# EAGLE schematic tentacle_module (EAGLE 7.1.0)
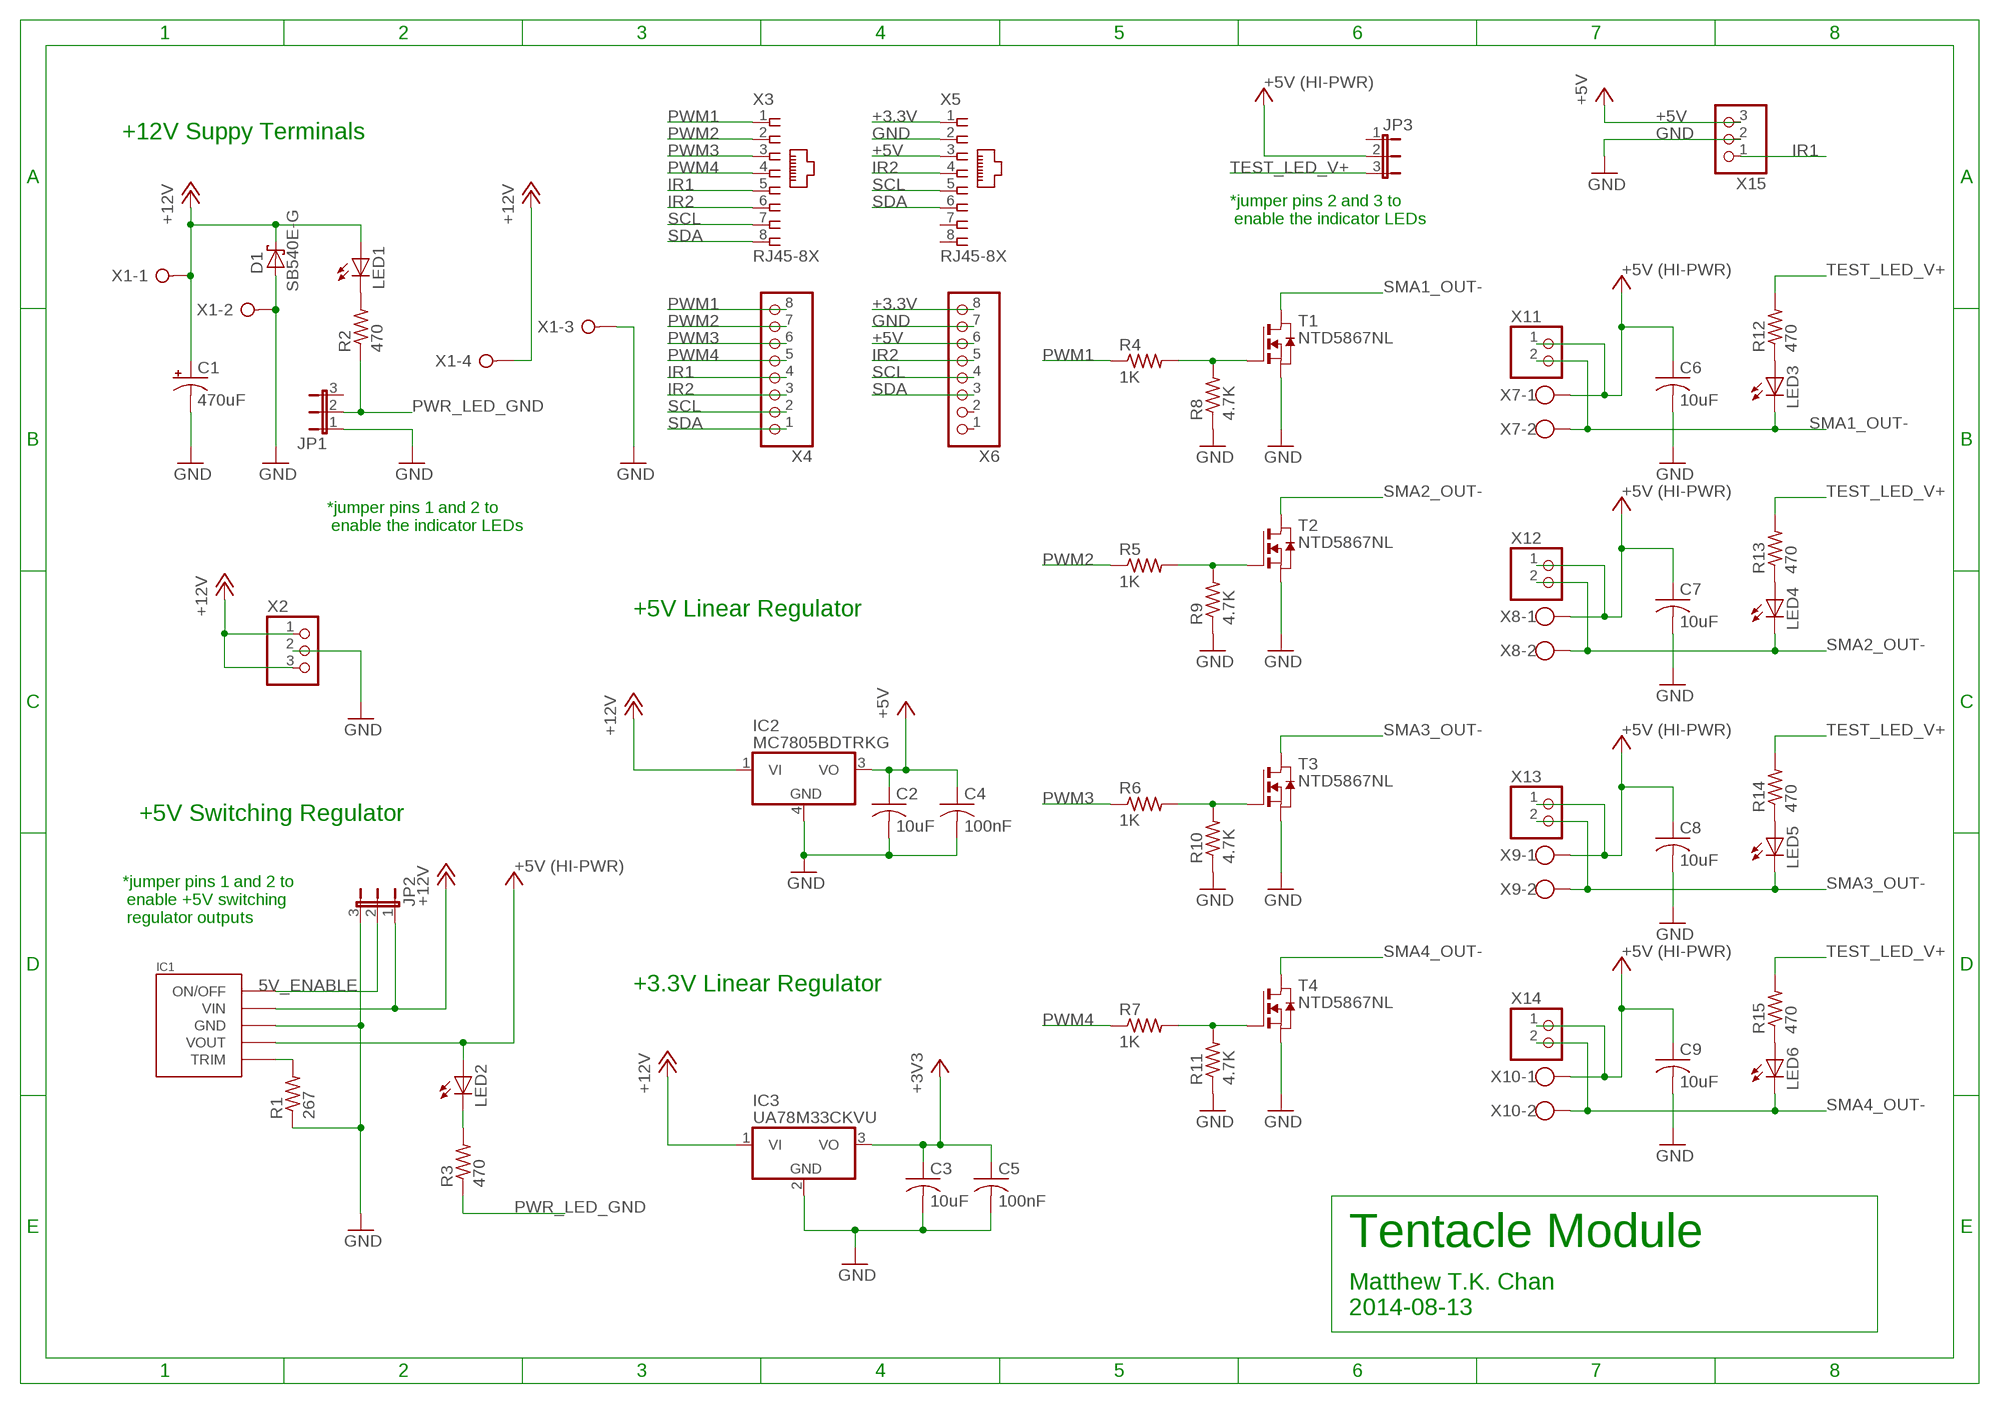
[diagram p0: schematic, sheet 1]

## Parts
C1  470uF  CPOL-USE5-10.5  [E5-10,5]
C2  10uF  C-USC1206  [C1206]
C3  10uF  C-USC1206  [C1206]
C4  100nF  C-USC0603  [C0603]
C5  100nF  C-USC0603  [C0603]
C6  10uF  C-USC1206  [C1206]
C7  10uF  C-USC1206  [C1206]
C8  10uF  C-USC1206  [C1206]
C9  10uF  C-USC1206  [C1206]
D1  SB540E-G  [DO201T15]
IC1  OKR-T/10-W12  [OKR-C90]
IC2  MC7805BDTRKG  [DPACK_3]
IC3  UA78M33CKVU  [DPACK]
JP1  JP2E  [JP2]
JP2  JP2E  [JP2]
JP3  JP2E  [JP2]
LED1  LEDSML1206  [SML1206]
LED2  LEDSML1206  [SML1206]
LED3  LEDSML1206  [SML1206]
LED4  LEDSML1206  [SML1206]
LED5  LEDSML1206  [SML1206]
LED6  LEDSML1206  [SML1206]
R1  267  R-US_R0603  [R0603]
R2  470  R-US_R0603  [R0603]
R3  470  R-US_R0603  [R0603]
R4  1K  R-US_R0603  [R0603]
R5  1K  R-US_R0603  [R0603]
R6  1K  R-US_R0603  [R0603]
R7  1K  R-US_R0603  [R0603]
R8  4.7K  R-US_R0603  [R0603]
R9  4.7K  R-US_R0603  [R0603]
R10  4.7K  R-US_R0603  [R0603]
R11  4.7K  R-US_R0603  [R0603]
R12  470  R-US_R0603  [R0603]
R13  470  R-US_R0603  [R0603]
R14  470  R-US_R0603  [R0603]
R15  470  R-US_R0603  [R0603]
T1  NTD5867NL  NTD5867NLT4G  [DPACK]
T2  NTD5867NL  NTD5867NLT4G  [DPACK]
T3  NTD5867NL  NTD5867NLT4G  [DPACK]
T4  NTD5867NL  NTD5867NLT4G  [DPACK]
X1  W237-04P  [W237-4P]
X2  PINHD-1X3/90  [1X03/90]
X3  RJ45-8X  [RJ45-NO-SHIELD]
X4  PINHD-1X8  [1X08]
X5  RJ45-8X  [RJ45-NO-SHIELD]
X6  PINHD-1X8  [1X08]
X7  W237-102  [W237-102]
X8  W237-102  [W237-102]
X9  W237-102  [W237-102]
X10  W237-102  [W237-102]
X11  PINHD-1X2/90  [1X02/90]
X12  PINHD-1X2/90  [1X02/90]
X13  PINHD-1X2/90  [1X02/90]
X14  PINHD-1X2/90  [1X02/90]
X15  PINHD-1X3/90  [1X03/90]

## Nets
5V_ENABLE: IC1.ON/OFF JP2.2
+3.3V: C3.1 C5.1 IC3.3(VO) X5.1 X6.8 ; supply symbol labelled +3V3
+5V: C2.1 C4.1 IC2.3(VO) X5.3 X6.6 X15.3
+5V_HI-PWR: C6.1 C7.1 C8.1 C9.1 IC1.VOUT JP3.2 LED2.A X7.1 X8.1 X9.1 X10.1 X11.1 X12.1 X13.1 X14.1 ; supply symbol labelled +5V (HI-PWR)
+12V: C1.+ D1.C IC1.VIN IC2.1(VI) IC3.1(VI) JP2.1 LED1.A X1.1 X1.4 X2.1 X2.3
GND: C1.- C2.2 C3.2 C4.2 C5.2 C6.2 C7.2 C8.2 C9.2 D1.A IC1.GND IC2.4(GND) IC3.2(GND) JP1.1 JP2.3 R1.1 R8.1 R9.1 R10.1 R11.1 T1.3(S) T2.3(S) T3.3(S) T4.3(S) X1.2 X1.3 X2.2 X5.2 X6.7 X15.2
IR1: X3.5 X4.4 X15.1
IR2: X3.6 X4.3 X5.4 X6.5
N$1: R5.2 R9.2 T2.1(G)
N$2: R6.2 R10.2 T3.1(G)
N$3: R7.2 R11.2 T4.1(G)
N$4: R4.2 R8.2 T1.1(G)
N$5: LED3.A R12.1
N$6: IC1.TRIM R1.2
N$7: LED2.C R3.2
N$10: LED1.C R2.2
N$12: LED4.A R13.1
N$13: LED5.A R14.1
N$14: LED6.A R15.1
PWM1: R4.1 X3.1 X4.8
PWM2: R5.1 X3.2 X4.7
PWM3: R6.1 X3.3 X4.6
PWM4: R7.1 X3.4 X4.5
PWR_LED_GND: JP1.2 R2.1 R3.1
SCL: X3.7 X4.2 X5.5 X6.4
SDA: X3.8 X4.1 X5.6 X6.3
SMA1_OUT-: LED3.C T1.2(D) X7.2 X11.2
SMA2_OUT-: LED4.C T2.2(D) X8.2 X12.2
SMA3_OUT-: LED5.C T3.2(D) X9.2 X13.2
SMA4_OUT-: LED6.C T4.2(D) X10.2 X14.2
TEST_LED_V+: JP3.3 R12.2 R13.2 R14.2 R15.2
Unconnected: JP1.3 JP3.1 X5.7 X5.8 X6.1 X6.2

## Notes on the sheet
- +12V Suppy Terminals
- *jumper pins 2 and 3 to
   enable the indicator LEDs
- *jumper pins 1 and 2 to
   enable the indicator LEDs
- +5V Linear Regulator
- +5V Switching Regulator
- *jumper pins 1 and 2 to
   enable +5V switching 
   regulator outputs
- +3.3V Linear Regulator
- Tentacle Module
- Matthew T.K. Chan
  2014-08-13

## Library data of the parts
C1 = rcl:CPOL-US: POLARIZED CAPACITOR, American symbol
C2-C9 = rcl:C-US: CAPACITOR, American symbol
D1 = CBLA_Test_bed_Library:SB540E-G: SCHOTTKY BARRIER RECTIFIER 3.0 AMPERES 20, 30, 40 VOLT Source: MBRS340T3-D.pdf
IC1 = CBLA_Test_bed_Library:OKR-T/10-W12: 5V/10A Murata POL DC/DC Converter
IC2 = CBLA_Test_bed_Library:MC78: 1A Positive Voltage Regulators Source: Data sheet <http://www.onsemi.com/pub_link/Collateral/MC7800-D.PDF>
IC3 = CBLA_Test_bed_Library:UA78M: Linear Voltage Reg Datasheet <http://www.ti.com/lit/ds/symlink/ua78m05.pdf>
JP1-JP3 = jumper:JP2E: JUMPER
LED1-LED6 = led:LED: LED OSRAM: - CHIPLED LG R971, LG N971, LY N971, LG Q971, LY Q971, LO R971, LY R971 LH N974, LH R974 LS Q976, LO Q976, LY Q976 LO Q996 - Hyper CHIPLED LW Q18S LB Q993, LB Q99A, LB R99A - SideLED LS A670, LO A670, LY A670, LG A670, LP A670 LB A673, LV A673, LT A673, LW A673 LH A674 LY A675 LS A676, LA A676, LO A676, LY A676, LW A676 LS A679, LY A679, LG A679 - Hyper Micro SIDELED® LS Y876, LA Y876, LO Y876, LY Y876 LT Y87S - SmartLED LW L88C, LW L88S LB L89C, LB L89S, LG L890 LS L89K, LO L89K, LY L89K LS L896, LA L896, LO L896, LY L896 - TOPLED LS T670, LO T670, LY T670, LG T670, LP T670 LSG T670, LSP T670, LSY T670, LOP T670, LYG T670 LG T671, LOG T671, LSG T671 LB T673, LV T673, LT T673, LW T673 LH T674 LS T676, LA T676, LO T676, LY T676, LB T676, LH T676, LSB T676, LW T676 LB T67C, LV T67C, LT T67C, LS T67K, LO T67K, LY T67K, LW E67C LS E67B, LA E67B, LO E67B, LY E67B, LB E67C, LV E67C, LT E67C LW T67C LS T679, LY T679, LG T679 LS T770, LO T770, LY T770, LG T770, LP T770 LB T773, LV T773, LT T773, LW T773 LH T774 LS E675, LA E675, LY E675, LS T675 LS T776, LA T776, LO T776, LY T776, LB T776 LHGB T686 LT T68C, LB T68C - Hyper Mini TOPLED® LB M676 - Mini TOPLED Santana® LG M470 LS M47K, LO M47K, LY M47K Source: http://www.osram.convergy.de LUXEON: - LUMILED® LXK2-PW12-R00, LXK2-PW12-S00, LXK2-PW14-U00, LXK2-PW14-V00 LXK2-PM12-R00, LXK2-PM12-S00, LXK2-PM14-U00 LXK2-PE12-Q00, LXK2-PE12-R00, LXK2-PE12-S00, LXK2-PE14-T00, LXK2-PE14-U00 LXK2-PB12-K00, LXK2-PB12-L00, LXK2-PB12-M00, LXK2-PB14-N00, LXK2-PB14-P00, LXK2-PB14-Q00 LXK2-PR12-L00, LXK2-PR12-M00, LXK2-PR14-Q00, LXK2-PR14-R00 LXK2-PD12-Q00, LXK2-PD12-R00, LXK2-PD12-S00 LXK2-PH12-R00, LXK2-PH12-S00 LXK2-PL12-P00, LXK2-PL12-Q00, LXK2-PL12-R00 Source: www.luxeon.com KINGBRIGHT: KA-3528ASYC Source: www.kingbright.com
R1-R15 = CBLA_Test_bed_Library:R-US_: RESISTOR, American symbol
T1-T4 = CBLA_Test_bed_Library:NTD5867NL: MOS FET
X1 = con-wago-508:W237-04P: WAGO SREW CLAMP; OC_FARNELL: unknown; OC_NEWARK: unknown
X2 X15 = CBLA_Test_bed_Library:PINHD-1X3: PIN HEADER
X3 X5 = CBLA_Test_bed_Library:RJ45: CORCOM Modular RJ Jacks No Shield Source: www.tycoelectronics.com .. ENG_DS_1654001_1099_RJ_L_0507.pdf; MPN: RJ45-8X; OC_FARNELL: unknown; OC_NEWARK: 16R6101
X4 X6 = CBLA_Test_bed_Library:PINHD-1X8: PIN HEADER
X7-X10 = con-wago-500:W237-102: WAGO SCREW CLAMP; MPN: 237-102; OC_FARNELL: unknown; OC_NEWARK: 70K9898
X11-X14 = CBLA_Test_bed_Library:PINHD-1X2: PIN HEADER